# Altium schematic sheet Bomp-countdown.SchDoc
size A4
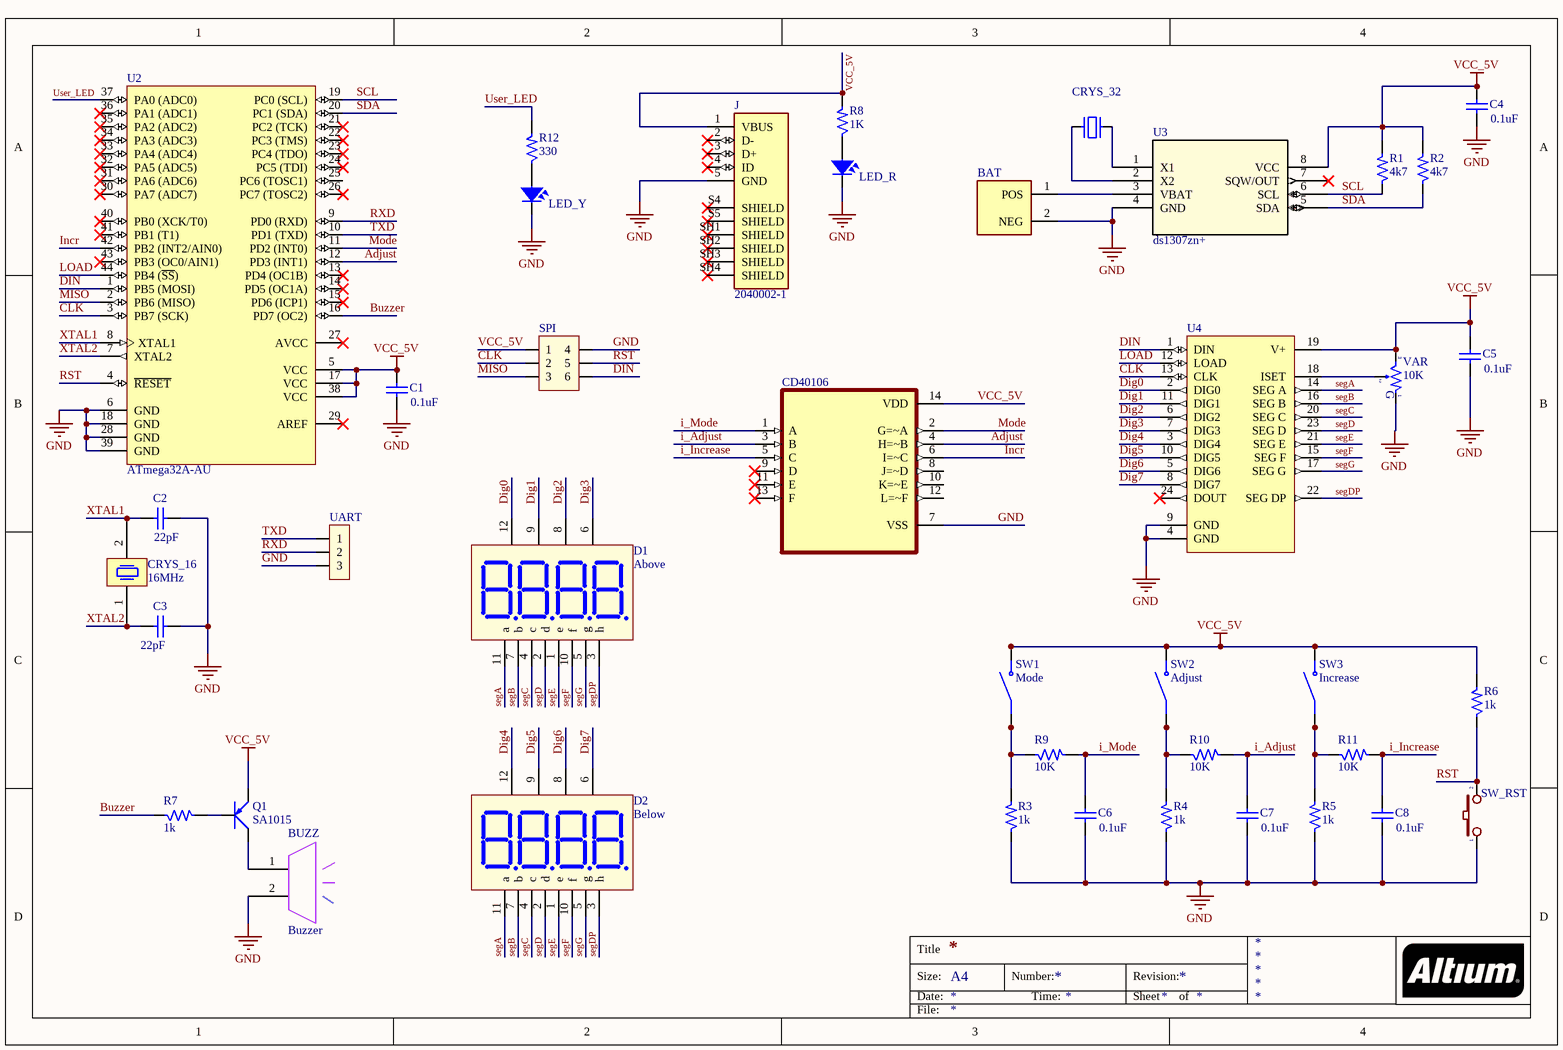
[diagram p0: Bomp-countdown.SchDoc]

## Parts
BAT  796136-1  [TE_796136-1]  (value not drawn)
BUZZ  Buzzer  [SPEAKER]
C1  0.1uF  [C0805]
C2  22pF  [C0805]
C3  22pF  [C0805]
C4  0.1uF  [C0805]
C5  0.1uF  [C0805]
C6  0.1uF  [C0805]
C7  0.1uF  [C0805]
C8  0.1uF  [C0805]
CD40106  CD40106BM  [SOIC127P600X175-14N]  (value not drawn)
CRYS_16  16MHz  [ABLS2-8.000MHZ-D4Y-T]
CRYS_32  32.768Khz  [XT32k]  (value not drawn)
D1  Above  [7SEGQ]
D2  Below  [7SEGQ]
J  2040002-1  [TE_2040002-1]
LED_R  LED SMD  [SM-LED-0805-Red]  (value not drawn)
LED_Y  LED SMD  [SM-LED-0805-Red]  (value not drawn)
Q1  SA1015  [SOT23-321]
R1  4k7  [SM-RES-1206]
R2  4k7  [SM-RES-1206]
R3  1k  [SM-RES-1206]
R4  1k  [SM-RES-1206]
R5  1k  [SM-RES-1206]
R6  1k  [SM-RES-1206]
R7  1k  [SM-RES-1206]
R8  1K  [SM-RES-1206]
R9  10K  [SM-RES-1206]
R10  10K  [SM-RES-1206]
R11  10K  [SM-RES-1206]
R12  330  [SM-RES-1206]
SPI  Connector 3x2  [JP3x2]  (value not drawn)
SW1  Mode  [SW_1571527-1]
SW2  Adjust  [SW_1571527-1]
SW3  Increase  [SW_1571527-1]
SW_RST  RST  [SW1-SMD]  (value not drawn)
U2  ATmega32A-AU  [TQFP44]
U3  ds1307zn+  [21-0041B_8_MXM]
U4  MAX7219ENG  [SO24]  (value not drawn)
UART  Jumper 3  [JP3]  (value not drawn)
VAR  10K  [VR-S1]

## Nets
GND: BAT.2(NEG) BUZZ.2 C1.1 C2.2 C3.2 C4.1 C5.1 C6.1 C7.1 C8.1 CD40106.7(VSS) J.5(GND) LED_R.2 LED_Y.2 R3.1 R4.1 R5.1 SPI.4 SW_RST.1 U2.6(GND) U2.18(GND) U2.28(GND) U2.39(GND) U3.4(GND) U4.4(GND) U4.9(GND) UART.3 VAR.1
VCC_5V: C1.2 C4.2 C5.2 CD40106.14(VDD) J.1(VBUS) Q1.1(E) R1.2 R2.2 R6.2 R8.2 SPI.1 SW1.3(NO) SW1.4(NO) SW2.3(NO) SW2.4(NO) SW3.3(NO) SW3.4(NO) U2.5(VCC) U2.17(VCC) U2.38(VCC) U3.8(VCC) U4.19(V+) VAR.3
Adjust: CD40106.4(H=~B) U2.12(PD3_(INT1))
Buzzer: R7.1 U2.16(PD7_(OC2))
CLK: SPI.2 U2.3(PB7_(SCK)) U4.13(CLK)
Dig0: D1.12(V1) U4.2(DIG0)
Dig1: D1.9(V2) U4.11(DIG1)
Dig2: D1.8(V3) U4.6(DIG2)
Dig3: D1.6(V4) U4.7(DIG3)
Dig4: D2.12(V1) U4.3(DIG4)
Dig5: D2.9(V2) U4.10(DIG5)
Dig6: D2.8(V3) U4.5(DIG6)
Dig7: D2.6(V4) U4.8(DIG7)
DIN: SPI.6 U2.1(PB5_(MOSI)) U4.1(DIN)
i_Adjust: C7.2 CD40106.3(B) R10.2
i_Increase: C8.2 CD40106.5(C) R11.2
i_Mode: C6.2 CD40106.1(A) R9.2
Incr: CD40106.6(I=~C) U2.42(PB2_(INT2/AIN0))
LOAD: U2.44(PB4_(~{SS})) U4.12(LOAD)
MISO: SPI.3 U2.2(PB6_(MISO))
Mode: CD40106.2(G=~A) U2.11(PD2_(INT0))
RST: R6.1 SPI.5 SW_RST.2 U2.4(~{RESET})
RXD: U2.9(PD0_(RXD)) UART.2
SCL: R1.1 U2.19(PC0_(SCL)) U3.6(SCL)
SDA: R2.1 U2.20(PC1_(SDA)) U3.5(SDA)
segA: D1.11(a) D2.11(a) U4.14(SEG_A)
segB: D1.7(b) D2.7(b) U4.16(SEG_B)
segC: D1.4(c) D2.4(c) U4.20(SEG_C)
segD: D1.2(d) D2.2(d) U4.23(SEG_D)
segDP: D1.3(h) D2.3(h) U4.22(SEG_DP)
segE: D1.1(e) D2.1(e) U4.21(SEG_E)
segF: D1.10(f) D2.10(f) U4.15(SEG_F)
segG: D1.5(g) D2.5(g) U4.17(SEG_G)
TXD: U2.10(PD1_(TXD)) UART.1
User_LED: R12.2 U2.37(PA0_(ADC0))
XTAL1: C2.1 CRYS_16.2 U2.8(XTAL1)
XTAL2: C3.1 CRYS_16.1 U2.7(XTAL2)
NetBAT_1: BAT.1(POS) U3.3(VBAT)
NetBUZZ_1: BUZZ.1 Q1.2(C)
NetCRYS_32_1: CRYS_32.1 U3.2(X2)
NetCRYS_32_2: CRYS_32.2 U3.1(X1)
NetLED_R_1: LED_R.1 R8.1
NetLED_Y_1: LED_Y.1 R12.1
NetQ1_3: Q1.3(B) R7.2
NetR3_2: R3.2 R9.1 SW1.1(COM) SW1.2(COM)
NetR4_2: R4.2 R10.1 SW2.1(COM) SW2.2(COM)
NetR5_2: R5.2 R11.1 SW3.1(COM) SW3.2(COM)
NetU4_18: U4.18(ISET) VAR.2

Not connected (* = marked no-connect by the designer): CD40106 8(J=~D) 9(D)* 10(K=~E) 11(E)* 12(L=~F) 13(F)*; J 2(D-)* 3(D+)* 4(ID)* S4(SHIELD)* S5(SHIELD)* SH1(SHIELD)* SH2(SHIELD)* SH3(SHIELD)* SH4(SHIELD)*; U2 13(PD4_(OC1B))* 14(PD5_(OC1A))* 15(PD6_(ICP1))* 21(PC2_(TCK))* 22(PC3_(TMS))* 23(PC4_(TDO))* 24(PC5_(TDI))* 25(PC6_(TOSC1)) 26(PC7_(TOSC2))* 27(AVCC)* 29(AREF)* 30(PA7_(ADC7))* 31(PA6_(ADC6))* 32(PA5_(ADC5))* 33(PA4_(ADC4))* 34(PA3_(ADC3))* 35(PA2_(ADC2))* 36(PA1_(ADC1))* 40(PB0_(XCK/T0))* 41(PB1_(T1))* 43(PB3_(OC0/AIN1))*; U3 7(SQW/OUT)*; U4 24(DOUT)*

## Notes on the sheet
- Title
- Size:
- Date:
- A4
- Number:
- Time:
- Revision:
- Sheet
- of
- File:
- (in symbol VR-S) G

## Library data of the parts
BAT = 796136-1: BATTERY HOLDER; No. of Batteries:1; Terminal Type:Surface Mount; For Use With:CR2032 Batteries; Accessory Type:Battery Holder; Battery Size Code:2032; Number_of_Positions: 2; MF: TE Connectivity; Package: None; Value: *; TE_purchase_URL: https://www.te.com/usa-en/product-796136-1.html?te_bu=Cor&te_type=disp&te_campaign=seda_glo_cor-seda-global-disp-prtnr-fy19-seda-model-bom-cta_sma-317_1&elqCampaignId=32493; EU_RoHS_Compliance: Compliant; SnapEDA_Link: https://www.snapeda.com/parts/796136-1/TE%20Connectivity%20AMP%20Connectors/view-part/761452/?ref=snap; Availability: Unavailable; Price: None; MP: 796136-1
C1-C8 = CapSMD: Capacitor; Value: 33p; Published: 8-Jun-2000; LatestRevisionDate: 17-Jul-2002; LatestRevisionNote: Re-released for DXP Platform.; PackageReference: RAD-0.3; Publisher: Altium Limited
CD40106 = CD40106BM: CMOS Hex Schmitt Triggers 14-SOIC -55 to 125; MF: Texas Instruments; Package: SOIC-14 Texas Instruments; Availability: Unavailable; Texas_Instruments-Purchase-URL: https://snapeda.com/shop?store=Texas+Instruments&id=321259; MP: CD40106BM; SnapEDA_Link: https://www.snapeda.com/parts/CD40106BM/Texas%20Instruments/view-part/321259/?ref=snap; DigiKey-Purchase-URL: https://snapeda.com/shop?store=DigiKey&id=321259; Mouser-Purchase-URL: https://snapeda.com/shop?store=Mouser&id=321259; Value: *; Price: None
CRYS_16 = ABLS2-8.000MHZ-D4Y-T: Crystal, 8 MHz, SMD, 11.4mm x 4.7mm, 30 ppm, 18 pF, 30 ppm, ABLS2 Series; Manufacturer: ABRACON; Value: 8MHz; Component Type: Crystal; Manufacturer Part No: ABLS2-8.000MHZ-D4Y-T; Order Code: *; Supplier: *
CRYS_32 = XT2: Crystal, 32.768 KHz, -40 to 85 degC, 3.2 x 1.5 x 0.9 mm SMD; Value: 4Mhz
D1 D2 = LED7Q: Four 7 Seg Dipslay; Value: LED 7Q SEG
J = 2040002-1: Conn Micro USB 2.0 Type B RCP 5 POS 0.65mm Solder RA SMD 5 Terminal 1 Port T/R; MF: TE Connectivity; Number_of_Positions: 5; Product_Type: Connector; Centerline_Pitch: .65 mm[.025 in]; MP: 2040002-1; Price: None; Package: None; Value: *; Availability: Unavailable; TE_purchase_URL: https://www.te.com/usa-en/product-2040002-1.html?te_bu=Cor&te_type=disp&te_campaign=seda_glo_cor-seda-global-disp-prtnr-fy19-seda-model-bom-cta_sma-317_1&elqCampaignId=32493; SnapEDA_Link: https://www.snapeda.com/parts/2040002-1/TE%20Connectivity%20AMP%20Connectors/view-part/782025/?ref=snap
LED_R LED_Y = LED-SMD-0805
Q1 = 2SA1015: PNP 600mW, ECB; Value: A1015
R1-R6 R9-R11 = R: Resistor 1/4W; Value: R1/4W - 1K
R7 R8 R12 = R: Resistor for buzzer; Value: R1/4W - 1K
SPI = JP3x2: Value: Connector 3x2
SW1-SW3 = 1571527-1: Switch Tactile OFF _ON_ Round Button Gull Wing 0.05A 12VDC 0.98N SMD Bulk; MF: TE Connectivity; MP: 1571527-1; EU_RoHS_Compliance: Compliant; SnapEDA_Link: https://www.snapeda.com/parts/1571527-1/TE%20Connectivity/view-part/244428/?ref=snap; Price: None; Package: SMD-6 Omron Electronics; Availability: Unavailable; TE_purchase_URL: https://www.te.com/usa-en/product-1571527-1.html?te_bu=Cor&te_type=disp&te_campaign=seda_glo_cor-seda-global-disp-prtnr-fy19-seda-model-bom-cta_sma-317_1&elqCampaignId=32493; Value: *
SW_RST = SW2: Switch button 2 pin; Value: SW chip 2 pin
U2 = ATmega32A-AU: 8/16-bit AVR XMEGA A4 Microcontroller, 1.6-3.6V, 32KB + 4KB Flash, 1KB EEPROM, 4KB SRAM, 44-pin TQFP, Industrial Grade (-40°C to 85°C), Pb-Free; Published: 1-Apr-2010; DatasheetVersion: revN, Feb-2010; PackageVersion: rev.B, Oct-2001; PackageReference: 44A; Publisher: Altium Limited; PackageDescription: 44-Pin Plastic Thin Profile Quad Flat Pack, 10 x 10 x 1.0 mm Body, 0.8 mm Pitch (TQFP); Supplier 1: Digi-Key; Supplier Part Number 1: ATXMEGA32A4-AU-ND; Supplier 2: Farnell; Supplier Part Number 2: 1748557; Supplier 3: Mouser; Supplier Part Number 3: 556-ATXMEGA32A4-AU; ComponentLink1Description: Manufacturer Link; ComponentLink1URL: http://www.atmel.com/products/avr/default.asp?; ComponentLink2Description: ATxmega16A4/32A4/64A4/128A4 Datasheet; ComponentLink2URL: http://www.atmel.com/dyn/resources/prod_documents/doc8069.pdf; ComponentLink3Description: Atmel.com Home; ComponentLink3URL: http://www.atmel.com
U3 = ds1307zn+: No Description Available; Mfr_Name: Maxim Integrated Products; Copyright: Copyright (C) 2021 Ultra Librarian. All rights reserved.; Manufacturer_Part_Number: ds1307zn+; RefDes: RefDes; Type: DEV
U4 = MAX7219ENG: Serially Interfaced, 8-Digit LED Display Driver; Published: 16-Jan-2001; LatestRevisionDate: 29-May-2009; LatestRevisionNote: Component Body Added.; DatasheetVersion: Jul-1997; PackageVersion: 1997; PackageReference: NG24A; Publisher: Altium Limited; PackageDescription: DIP, 24-Pin, Row Spacing 7.62 mm, Pitch 2.54 mm; Code_JEDEC: MS-001-AF; ComponentLink1Description: Manufacturer Link; ComponentLink1URL: http://www.maxim-ic.com/; ComponentLink2Description: Datasheet; ComponentLink2URL: http://pdfserv.maxim-ic.com/en/ds/MAX7219-MAX7221.pdf
UART = JP3: Value: J3
VAR = VR-S: Var Resistor; Value: Volume 50k